# EAGLE design new (EAGLE 7.5.0)
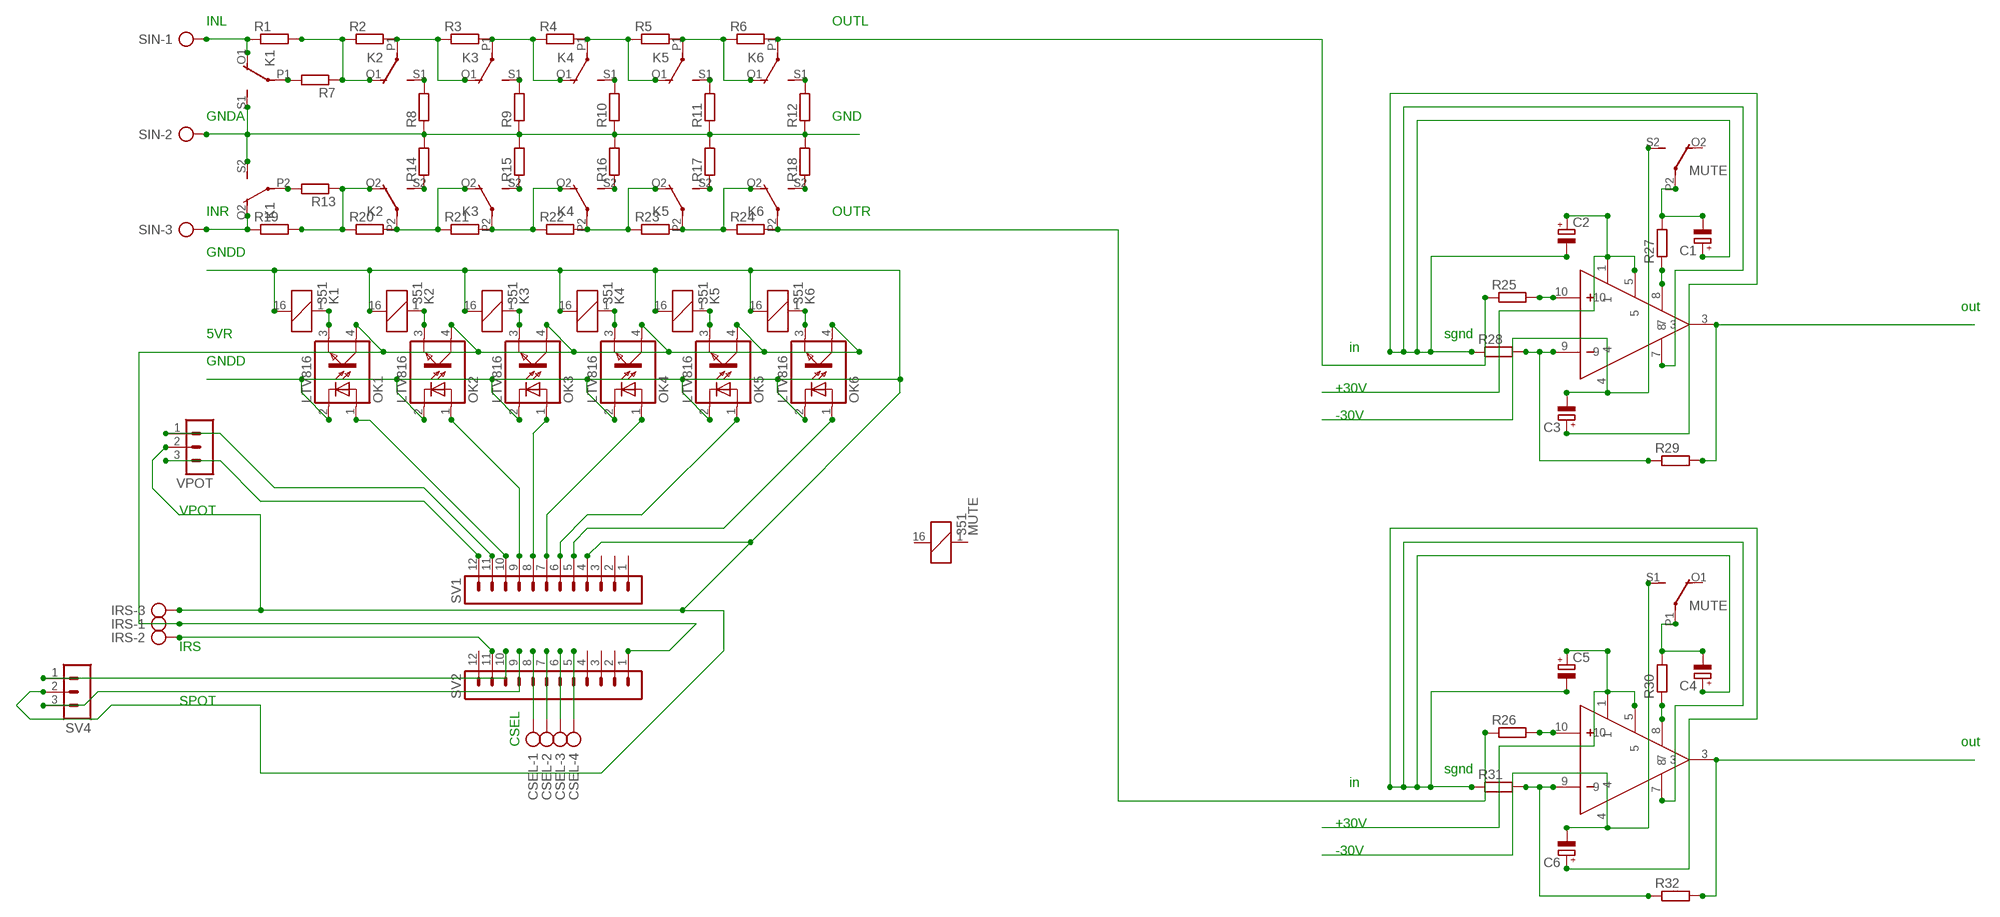
[diagram p0: schematic, sheet 1]

## Parts
C1  CPOL-EUE5-13  [E5-13]
C2  CPOL-EUE5-13  [E5-13]
C3  CPOL-EUE5-13  [E5-13]
C4  CPOL-EUE5-13  [E5-13]
C5  CPOL-EUE5-13  [E5-13]
C6  CPOL-EUE5-13  [E5-13]
CSEL  AK500/4  [AK500/4]
IRS  AK500/3  [AK500/3]
K1  351  [351]
K2  351  [351]
K3  351  [351]
K4  351  [351]
K5  351  [351]
K6  351  [351]
MUTE  351  [351]
OK1  LTV816  [DIL04]
OK2  LTV816  [DIL04]
OK3  LTV816  [DIL04]
OK4  LTV816  [DIL04]
OK5  LTV816  [DIL04]
OK6  LTV816  [DIL04]
R1  R-EU_0204/7  [0204/7]
R2  R-EU_0204/7  [0204/7]
R3  R-EU_0204/7  [0204/7]
R4  R-EU_0204/7  [0204/7]
R5  R-EU_0204/7  [0204/7]
R6  R-EU_0204/7  [0204/7]
R7  R-EU_0204/7  [0204/7]
R8  R-EU_0204/7  [0204/7]
R9  R-EU_0204/7  [0204/7]
R10  R-EU_0204/7  [0204/7]
R11  R-EU_0204/7  [0204/7]
R12  R-EU_0204/7  [0204/7]
R13  R-EU_0204/7  [0204/7]
R14  R-EU_0204/7  [0204/7]
R15  R-EU_0204/7  [0204/7]
R16  R-EU_0204/7  [0204/7]
R17  R-EU_0204/7  [0204/7]
R18  R-EU_0204/7  [0204/7]
R19  R-EU_0204/7  [0204/7]
R20  R-EU_0204/7  [0204/7]
R21  R-EU_0204/7  [0204/7]
R22  R-EU_0204/7  [0204/7]
R23  R-EU_0204/7  [0204/7]
R24  R-EU_0204/7  [0204/7]
R25  R-EU_0207/10  [0207/10]
R26  R-EU_0207/10  [0207/10]
R27  R-EU_0207/10  [0207/10]
R28  R-EU_0207/10  [0207/10]
R29  R-EU_0207/10  [0207/10]
R30  R-EU_0207/10  [0207/10]
R31  R-EU_0207/10  [0207/10]
R32  R-EU_0207/10  [0207/10]
SIN  AK500/3  [AK500/3]
SV1  MA12-1  [MA12-1]
SV2  MA12-1  [MA12-1]
SV4  MA03-1  [MA03-1]
U$1  LM3886T  [TO220-11]
U$2  LM3886T  [TO220-11]
VPOT  MA03-1  [MA03-1]

## Nets
GNDA: C1.+ C2.- C3.+ C4.+ C5.- C6.+ K1.S1(2:S) K1.S2(3:S) R8.1 R9.1 R10.1 R11.1 R12.1 R14.2 R15.2 R16.2 R17.2 R18.2 R28.1 R31.1 SIN.2 U$1.7 U$2.7
GNDD: IRS.3 K1.16 K2.16 K3.16 K4.16 K5.16 K6.16 OK1.2(C) OK2.2(C) OK3.2(C) OK4.2(C) OK5.2(C) OK6.2(C) SV1.4 SV4.2 VPOT.2
N$1: K2.O1(2:O) R1.2 R2.1 R7.1
N$2: K2.P1(2:P) K3.O1(2:O) R2.2 R3.1
N$3: K3.P1(2:P) K4.O1(2:O) R3.2 R4.1
N$4: K4.P1(2:P) K5.O1(2:O) R4.2 R5.1
N$5: K5.P1(2:P) K6.O1(2:O) R5.2 R6.1
N$6: K6.P1(2:P) R6.2 R25.1
N$7: K1.O1(2:O) R1.1 SIN.1
N$8: K1.P2(3:P) R13.2
N$9: K2.S1(2:S) R8.2
N$10: K3.S1(2:S) R9.2
N$11: K4.S1(2:S) R10.2
N$12: K5.S1(2:S) R11.2
N$13: K6.S1(2:S) R12.2
N$14: K1.P1(2:P) R7.2
N$15: K1.O2(3:O) R19.1 SIN.3
N$16: K5.S2(3:S) R17.1
N$17: K4.S2(3:S) R16.1
N$18: K3.S2(3:S) R15.1
N$19: K2.S2(3:S) R14.1
N$20: K6.S2(3:S) R18.1
N$21: CSEL.1 SV2.8
N$22: SV1.12 VPOT.3
N$23: K1.1 OK1.3(EMIT)
N$24: K2.1 OK2.3(EMIT)
N$25: K3.1 OK3.3(EMIT)
N$26: K4.1 OK4.3(EMIT)
N$27: K5.1 OK5.3(EMIT)
N$28: K2.P2(3:P) K3.O2(3:O) R20.2 R21.1
N$29: K3.P2(3:P) K4.O2(3:O) R21.2 R22.1
N$30: K4.P2(3:P) K5.O2(3:O) R22.2 R23.1
N$31: K2.O2(3:O) R13.1 R19.2 R20.1
N$32: K6.P2(3:P) R24.2 R26.1
N$33: K6.1 OK6.3(EMIT)
N$34: K5.P2(3:P) K6.O2(3:O) R23.2 R24.1
N$35: SV1.11 VPOT.1
N$36: OK6.1(A) SV1.5
N$37: OK5.1(A) SV1.6
N$38: OK4.1(A) SV1.7
N$39: OK3.1(A) SV1.8
N$40: OK2.1(A) SV1.9
N$41: OK1.1(A) SV1.10
N$42: SV2.10 SV4.1
N$43: SV2.9 SV4.3
N$44: CSEL.2 SV2.7
N$45: CSEL.3 SV2.6
N$46: CSEL.4 SV2.5
N$47: R25.2 U$1.10
N$48: C6.- MUTE.S1(2:S) U$2.4
N$49: IRS.2 SV2.11
N$50: IRS.1 OK1.4(COL) OK2.4(COL) OK3.4(COL) OK4.4(COL) OK5.4(COL) OK6.4(COL) SV2.1
N$51: R28.2 R29.1 U$1.9
N$52: R29.2 U$1.3
N$53: C2.+ U$1.1 U$1.5
N$55: R27.1 U$1.8
N$56: C1.- MUTE.P2(3:P) R27.2
N$57: C3.- MUTE.S2(3:S) U$1.4
N$58: R26.2 U$2.10
N$60: R32.2 U$2.3
N$61: C5.+ U$2.1 U$2.5
N$62: R31.2 R32.1 U$2.9
N$64: R30.1 U$2.8
N$65: C4.- MUTE.P1(2:P) R30.2
Unconnected: MUTE.1 MUTE.16 MUTE.O1(2:O) MUTE.O2(3:O) SV1.1 SV1.2 SV1.3 SV2.2 SV2.3 SV2.4 SV2.12

## Notes on the sheet
- INL | OUTL
- GNDA | GND
- INR | OUTR
- GNDD
- out
- 5VR | sgnd
- in
- GNDD
- +30V
- -30V
- VPOT
- IRS
- SPOT
- CSEL | out
- sgnd
- in
- +30V
- -30V

## Library data of the parts
C1-C6 = rcl:CPOL-EU: POLARIZED CAPACITOR, European symbol
CSEL = con-ptr500:AK500/4: CONNECTOR; OC_FARNELL: unknown; OC_NEWARK: unknown
IRS SIN = con-ptr500:AK500/3: CONNECTOR; OC_FARNELL: unknown; OC_NEWARK: unknown
K1-K6 MUTE = relay:351: RELAY 2 x switch, Omron; OC_FARNELL: unknown; OC_NEWARK: unknown
OK1-OK6 = optocoupler:LTV816: OPTO COUPLER Source: LITEON, LTV816.pdf; OC_FARNELL: unknown; OC_NEWARK: unknown
R1-R32 = rcl:R-EU_: RESISTOR, European symbol
SV1 SV2 = con-lstb:MA12-1: PIN HEADER; OC_FARNELL: unknown; OC_NEWARK: unknown
SV4 VPOT = con-lstb:MA03-1: PIN HEADER; OC_FARNELL: unknown; OC_NEWARK: unknown
U$1 U$2 = LM3886:LM3886

## Board
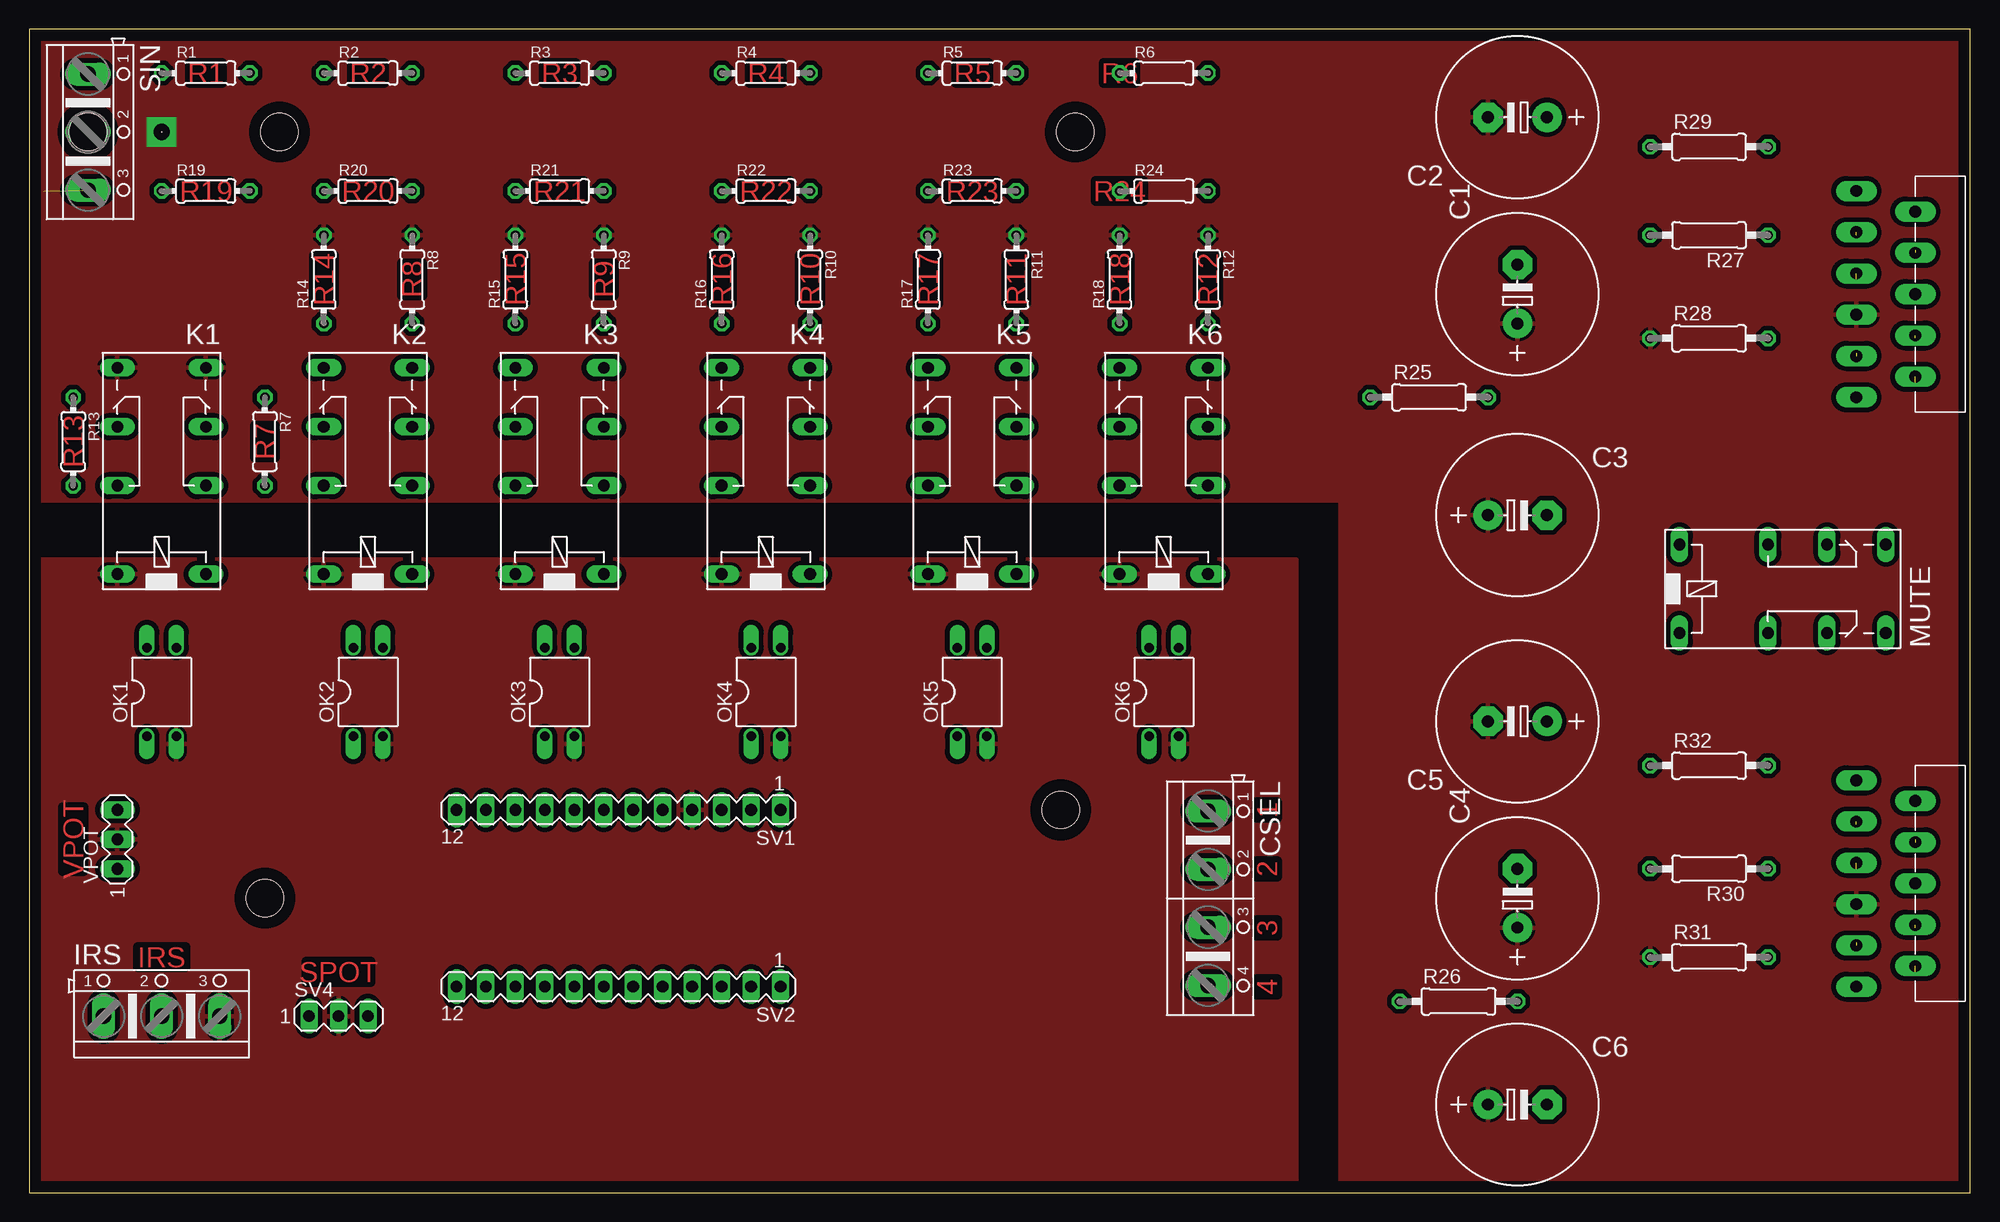
[diagram p1: board, top side]
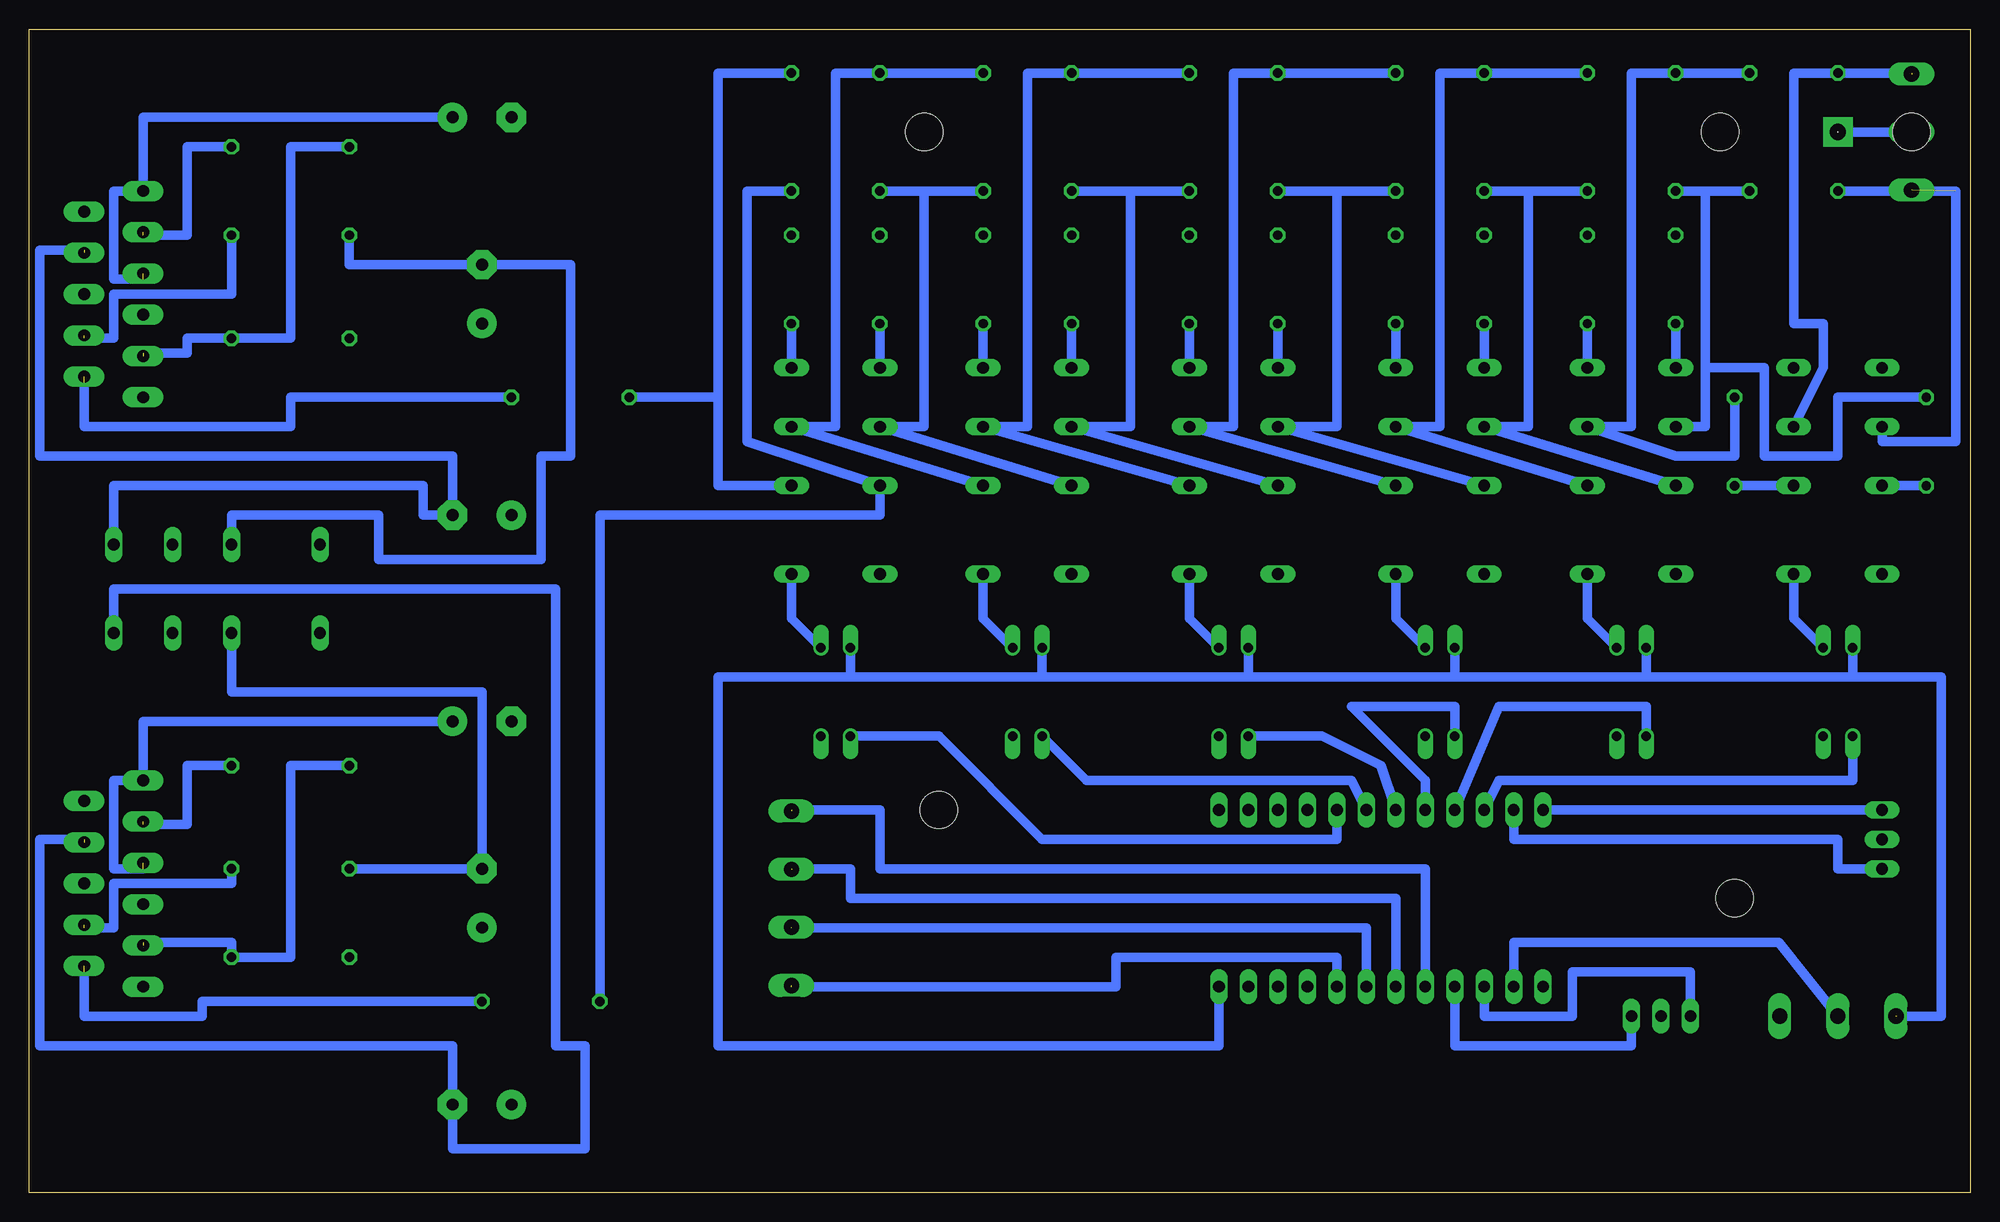
[diagram p2: board, bottom side, seen from below]

Size 167.31 x 100.32 mm. Coordinates in mm from the lower left corner, seen from the top.
Outline: 0,0 167.31,0 167.31,100.32 0,100.32 0,0
Copper layers (1*16): Top 0.035mm / dielectric 1.5mm / Bottom 0.035mm
Design rules "default *": minimum track width 30mil, minimum drill 24mil, track to track 16mil, track to pad 16mil, pad to pad 16mil, via to via 16mil, smd to smd 8mil, copper to edge 40mil, drill to drill 8mil, minimum pad ring 10mil, minimum via ring 8mil, stop-mask expansion 4mil, vias tented up to drill 0mil, thermal gap 10mil
Holes 3.2 mm at 21.59,91.44 90.17,91.44 20.32,25.4 88.9,33.02 5.08,91.44
Holes 0 mm at 11.43,91.44

### Footprints (pad centres in the part's own frame; a part is rotated, then mirrored left to right if it is on the bottom)
E5-13 = drill 1.016 pad 2.54: + -2.54,0 | drill 1.016 pad 2.54 octagon: - 2.54,0
AK500/4 = drill 1.321 long: 1 -7.518,0; 2 -2.489,0; 3 2.489,0; 4 7.518,0
AK500/3 = drill 1.321 long: 1 -5.004,0; 2 0,0; 3 5.004,0
351 = drill 1.016 long: 1 -3.81,-3.81; 16 -3.81,3.81; O1 8.89,-3.81; O2 8.89,3.81; P1 3.81,-3.81; P2 3.81,3.81; S1 13.97,-3.81; S2 13.97,3.81
DIL04 = drill 0.813 offset: 1 -1.27,-3.81; 2 1.27,-3.81; 3 1.27,3.81; 4 -1.27,3.81
0204/7 = drill 0.813 octagon: 1 -3.81,0; 2 3.81,0
0207/10 = drill 0.813 octagon: 1 -5.08,0; 2 5.08,0
MA12-1 = drill 1.016 long: 1 -13.97,0; 2 -11.43,0; 3 -8.89,0; 4 -6.35,0; 5 -3.81,0; 6 -1.27,0; 7 1.27,0; 8 3.81,0; 9 6.35,0; 10 8.89,0; 11 11.43,0; 12 13.97,0
MA03-1 = drill 1.016 long: 1 -2.54,0; 2 0,0; 3 2.54,0
TO220-11 = drill 1.016 pad 1.778 long: 1 -8.89,-2.54; 2 -7.112,2.54; 3 -5.334,-2.54; 4 -3.556,2.54; 5 -1.778,-2.54; 6 0,2.54; 7 1.778,-2.54; 8 3.556,2.54; 9 5.334,-2.54; 10 7.112,2.54; 11 8.89,-2.54

### Placement (x,y rotation side)
C1  128.27,77.47 90 top
C2  128.27,92.71 180 top
C3  128.27,58.42 0 top
C4  128.27,25.4 90 top
C5  128.27,40.64 180 top
C6  128.27,7.62 0 top
CSEL  101.6,25.4 270 top
IRS  11.43,15.24 0 top
K1  11.43,57.15 90 top
K2  29.21,57.15 90 top
K3  45.72,57.15 90 top
K4  63.5,57.15 90 top
K5  81.28,57.15 90 top
K6  97.79,57.15 90 top
MUTE  146.05,52.07 0 top
OK1  11.43,43.18 0 top
OK2  29.21,43.18 0 top
OK3  45.72,43.18 0 top
OK4  63.5,43.18 0 top
OK5  81.28,43.18 0 top
OK6  97.79,43.18 0 top
R1  15.24,96.52 0 top
R2  29.21,96.52 0 top
R3  45.72,96.52 0 top
R4  63.5,96.52 0 top
R5  81.28,96.52 0 top
R6  97.79,96.52 0 top
R7  20.32,64.77 270 top
R8  33.02,78.74 270 top
R9  49.53,78.74 270 top
R10  67.31,78.74 270 top
R11  85.09,78.74 270 top
R12  101.6,78.74 270 top
R13  3.81,64.77 270 top
R14  25.4,78.74 90 top
R15  41.91,78.74 90 top
R16  59.69,78.74 90 top
R17  77.47,78.74 90 top
R18  93.98,78.74 90 top
R19  15.24,86.36 0 top
R20  29.21,86.36 0 top
R21  45.72,86.36 0 top
R22  63.5,86.36 0 top
R23  81.28,86.36 0 top
R24  97.79,86.36 0 top
R25  120.65,68.58 0 top
R26  123.19,16.51 0 top
R27  144.78,82.55 180 top
R28  144.78,73.66 0 top
R29  144.78,90.17 0 top
R30  144.78,27.94 180 top
R31  144.78,20.32 0 top
R32  144.78,36.83 0 top
SIN  5.08,91.44 270 top
SV1  50.8,33.02 180 top
SV2  50.8,17.78 180 top
SV4  26.67,15.24 0 top
U$1  160.02,77.47 270 top
U$2  160.02,26.67 270 top
VPOT  7.62,30.48 90 top

### Tracks (layer width: path | path; a pad name or v marks a point on that pad's centre or on a via)
GNDA  (via drill 1.4 pad 2.54)
  Bottom 0.813: SIN.2 v11.43,91.44
  pour Top: 0,59.69 0,100.33 167.64,100.33 167.64,0 113.03,0 113.03,59.69
GNDD
  pour Top: 0,54.61 109.22,54.61 109.22,0 0,0
N$1
  Bottom 0.813: R1.2 R2.1 29.21,96.52 29.21,66.04 K2.O1 25.4,63.5 20.32,63.5 R7.1
N$2
  Bottom 0.813: R2.2 R3.1 45.72,96.52 45.72,66.04 K3.O1 K2.P1
N$3
  Bottom 0.813: R3.2 R4.1 63.5,96.52 63.5,66.04 K4.O1 K3.P1
N$4
  Bottom 0.813: R4.2 R5.1 81.28,96.52 81.28,66.04 K5.O1 K4.P1
N$5
  Bottom 0.813: R5.2 R6.1 97.79,96.52 97.79,66.04 K6.O1 K5.P1
N$6
  Bottom 0.813: K6.P1 107.95,60.96 107.95,68.58 | 107.95,68.58 107.95,96.52 R6.2 | 107.95,68.58 R25.1
N$7  (1 unrouted)
  Bottom 0.813: 5.08,96.52 R1.1 15.24,96.52 15.24,74.93 12.7,74.93 12.7,71.12 K1.O1
N$8
  Bottom 0.813: R13.2 K1.P2
N$9
  Bottom 0.813: R8.2 K2.S1
N$10
  Bottom 0.813: R9.2 K3.S1
N$11
  Bottom 0.813: R10.2 K4.S1
N$12
  Bottom 0.813: R11.2 K5.S1
N$13
  Bottom 0.813: R12.2 K6.S1
N$14
  Bottom 0.813: K1.P1 R7.2
N$15  (1 unrouted)
  Bottom 0.813: R19.1 1.27,86.36 1.27,64.77 7.62,64.77 K1.O2
N$16
  Bottom 0.813: R17.1 K5.S2
N$17
  Bottom 0.813: R16.1 K4.S2
N$18
  Bottom 0.813: R15.1 K3.S2
N$19
  Bottom 0.813: R14.1 K2.S2
N$20
  Bottom 0.813: R18.1 K6.S2
N$21  (1 unrouted)
  Bottom 0.813: 101.6,33.02 93.98,33.02 93.98,27.94 46.99,27.94 SV2.8
N$22
  Bottom 0.813: VPOT.3 SV1.12
N$23
  Bottom 0.813: OK1.3 15.24,49.53 K1.1
N$24
  Bottom 0.813: OK2.3 33.02,49.53 K2.1
N$25
  Bottom 0.813: OK3.3 49.53,49.53 K3.1
N$26
  Bottom 0.813: OK4.3 67.31,49.53 K4.1
N$27
  Bottom 0.813: OK5.3 85.09,49.53 K5.1
N$28
  Bottom 0.813: R20.2 38.1,86.36 | 38.1,86.36 R21.1 | K2.P2 K3.O2 38.1,66.04 38.1,86.36
N$29
  Bottom 0.813: R21.2 54.61,86.36 | 54.61,86.36 R22.1 | K3.P2 K4.O2 54.61,66.04 54.61,86.36
N$30
  Bottom 0.813: R22.2 72.39,86.36 | 72.39,86.36 R23.1 | K4.P2 K5.O2 72.39,66.04 72.39,86.36
N$31
  Bottom 0.813: R19.2 22.86,86.36 | 22.86,86.36 R20.1 | 22.86,86.36 22.86,71.12 | 22.86,71.12 22.86,66.04 K2.O2 | R13.1 11.43,68.58 11.43,63.5 17.78,63.5 17.78,71.12 22.86,71.12
N$32
  Bottom 0.813: R24.2 105.41,86.36 105.41,64.77 K6.P2 93.98,58.42 118.11,58.42 R26.1
N$33
  Bottom 0.813: OK6.3 101.6,49.53 K6.1
N$34
  Bottom 0.813: R23.2 87.63,86.36 90.17,86.36 | 90.17,86.36 R24.1 | K5.P2 K6.O2 90.17,66.04 90.17,86.36
N$35
  Bottom 0.813: VPOT.1 11.43,27.94 11.43,30.48 39.37,30.48 SV1.11
N$36
  Bottom 0.813: OK6.1 88.9,39.37 80.01,30.48 54.61,30.48 SV1.5
N$37
  Bottom 0.813: OK5.1 76.2,35.56 53.34,35.56 SV1.6
N$38
  Bottom 0.813: OK4.1 55.88,39.37 50.8,36.83 SV1.7
N$39
  Bottom 0.813: OK3.1 44.45,41.91 53.34,41.91 46.99,35.56 SV1.8
N$40
  Bottom 0.813: OK2.1 27.94,41.91 40.64,41.91 SV1.9
N$41
  Bottom 0.813: OK1.1 10.16,35.56 40.64,35.56 SV1.10
N$42
  Bottom 0.813: SV4.1 24.13,19.05 34.29,19.05 34.29,15.24 41.91,15.24 SV2.10
N$43
  Bottom 0.813: SV4.3 29.21,12.7 44.45,12.7 SV2.9
N$44  (1 unrouted)
  Bottom 0.813: SV2.7 49.53,25.4 96.52,25.4 96.52,27.94 101.6,27.94
N$45  (1 unrouted)
  Bottom 0.813: SV2.6 52.07,22.86 101.6,22.86
N$46  (1 unrouted)
  Bottom 0.813: SV2.5 54.61,20.32 73.66,20.32 73.66,17.78 101.6,17.78
N$47  (1 unrouted)
  Bottom 0.813: 162.56,69.85 162.56,66.04 144.78,66.04 144.78,68.58 R25.2
N$48  (1 unrouted)
  Bottom 0.813: 162.56,30.48 166.37,30.48 166.37,12.7 130.81,12.7 C6.- 130.81,3.81 119.38,3.81 119.38,12.7 121.92,12.7 121.92,52.07 160.02,52.07 MUTE.S1
N$49
  Bottom 0.813: SV2.11 39.37,21.59 16.51,21.59 IRS.2
N$50  (1 unrouted)
  Bottom 0.813: OK6.4 96.52,44.45 | 96.52,44.45 107.95,44.45 107.95,12.7 64.77,12.7 SV2.1 | OK5.4 80.01,44.45 | 80.01,44.45 96.52,44.45 | 80.01,44.45 62.23,44.45 | 62.23,44.45 44.45,44.45 | 44.45,44.45 27.94,44.45 | 27.94,44.45 10.16,44.45 | 10.16,44.45 OK1.4 | OK2.4 27.94,44.45 | OK3.4 44.45,44.45 | OK4.4 62.23,44.45 | 10.16,44.45 2.54,44.45 2.54,15.24 6.35,15.24
N$51  (1 unrouted)
  Bottom 0.813: 157.48,72.39 153.67,72.39 153.67,73.66 R28.2 144.78,73.66 144.78,90.17 R29.1
N$52  (1 unrouted)
  Bottom 0.813: R29.2 153.67,90.17 153.67,82.55 157.48,82.55
N$53  (1 unrouted)
  Bottom 0.813: 157.48,78.74 160.02,78.74 160.02,86.36 U$1.1 157.48,92.71 C2.+
N$55  (1 unrouted)
  Bottom 0.813: R27.1 149.86,77.47 160.02,77.47 160.02,73.66 162.56,73.66
N$56
  Bottom 0.813: R27.2 139.7,80.01 C1.- 120.65,80.01 120.65,63.5 123.19,63.5 123.19,54.61 137.16,54.61 137.16,58.42 149.86,58.42 MUTE.P2
N$57  (1 unrouted)
  Bottom 0.813: 162.56,81.28 166.37,81.28 166.37,63.5 130.81,63.5 C3.- 133.35,58.42 133.35,60.96 160.02,60.96 MUTE.S2
N$58  (1 unrouted)
  Bottom 0.813: 162.56,19.05 162.56,15.24 152.4,15.24 152.4,16.51 130.81,16.51 129.54,16.51 R26.2
N$60  (1 unrouted)
  Bottom 0.813: R32.2 153.67,36.83 153.67,31.75 157.48,31.75
N$61  (1 unrouted)
  Bottom 0.813: C5.+ 157.48,40.64 U$2.1 160.02,35.56 160.02,27.94 157.48,27.94
N$62  (1 unrouted)
  Bottom 0.813: 157.48,21.59 149.86,21.59 R31.2 144.78,20.32 144.78,36.83 R32.1
N$64  (1 unrouted)
  Bottom 0.813: R30.1 149.86,26.67 160.02,26.67 160.02,22.86 162.56,22.86
N$65
  Bottom 0.813: R30.2 C4.- 128.27,43.18 149.86,43.18 MUTE.P1

### Text on the board
Top: R1 | R2 | R3 | R4 | R5 | R6 | R19 | R20 | R21 | R22 | R23 | R24 | R14 | R8 | R15 | R9 | R16 | R10 | R17 | R11 | R18 | R12 | R13 | R7 | 1 | VPOT | 2 | 3 | IRS | SPOT | 4